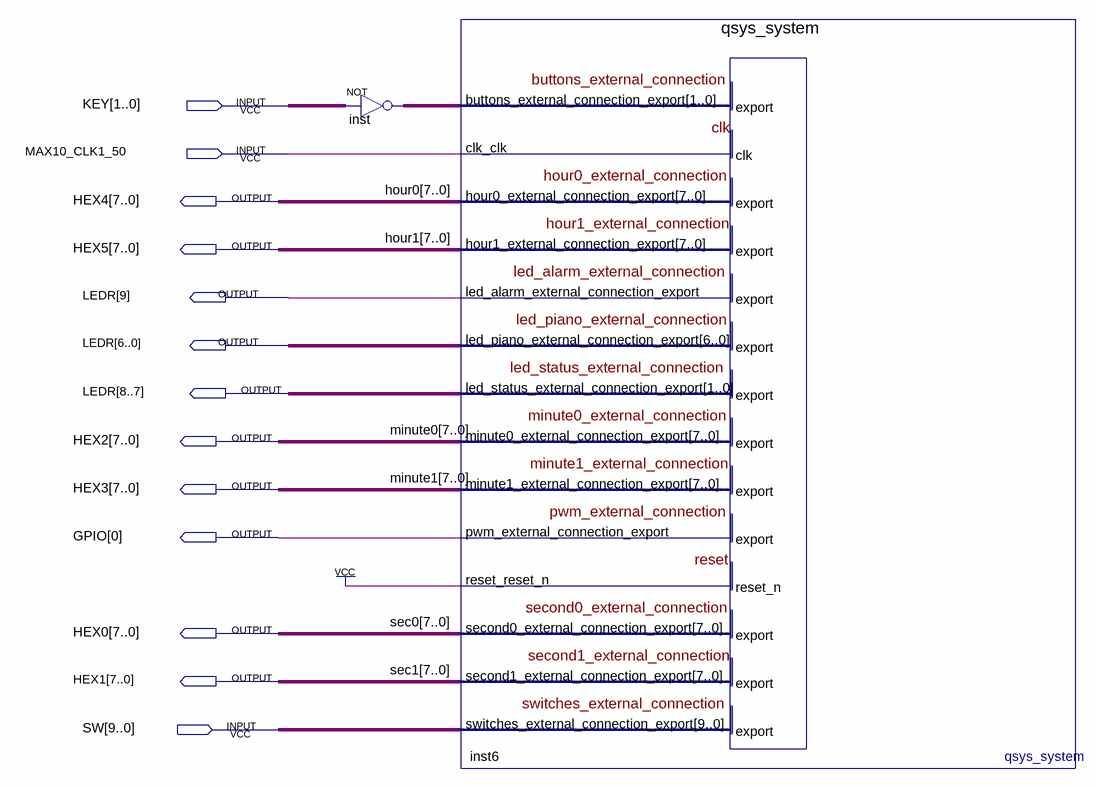
[diagram p0: schematic sheet]
// Quartus schematic system_block.bdf as structural Verilog: 2 symbols, 13 pins
module system_block (
  input  [1:0] KEY,
  input  MAX10_CLK1_50,
  input  [9:0] SW,
  output [7:0] HEX4,
  output [7:0] HEX5,
  output [9:0] LEDR,
  output [7:0] HEX2,
  output [7:0] HEX3,
  output [0:0] GPIO,
  output [7:0] HEX0,
  output [7:0] HEX1
);

  wire [1:0] inst_out;

  assign inst_out = ~KEY;  // NOT inst, 2 bits wide
  qsys_system inst6 (
    .buttons_external_connection_export(inst_out), .clk_clk(MAX10_CLK1_50), .reset_reset_n(1'b1),
    .switches_external_connection_export(SW), .hour0_external_connection_export(HEX4),
    .hour1_external_connection_export(HEX5), .led_alarm_external_connection_export(LEDR[9]),
    .led_piano_external_connection_export(LEDR[6:0]), .led_status_external_connection_export(LEDR[8:7]),
    .minute0_external_connection_export(HEX2), .minute1_external_connection_export(HEX3),
    .pwm_external_connection_export(GPIO[0]), .second0_external_connection_export(HEX0),
    .second1_external_connection_export(HEX1));

  // Other names for the same wires on the sheet: hour0[7:0] = HEX4; hour1[7:0] = HEX5; minute0[7:0] = HEX2;
  //   minute1[7:0] = HEX3; sec0[7:0] = HEX0; sec1[7:0] = HEX1
endmodule
